# EAGLE schematic rf_rx (EAGLE 6.5.0)
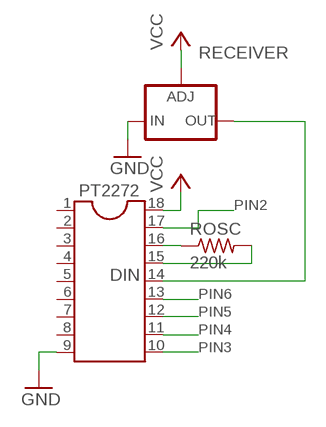
[diagram p0: schematic, sheet 1]

## Parts
PT2272  DIL18  [DIL18]
RECEIVER  LM337TS  [337TS]
ROSC  220k  R-US_0204/5  [0204/5]

## Nets
DIN: PT2272.14 RECEIVER.3(OUT)
GND: PT2272.9 RECEIVER.2(IN)
N$23: PT2272.16 ROSC.1
N$24: PT2272.15 ROSC.2
PIN2: PT2272.17
PIN3: PT2272.10
PIN4: PT2272.11
PIN5: PT2272.12
PIN6: PT2272.13
VCC: PT2272.18 RECEIVER.1(ADJ)
Unconnected: PT2272.1 PT2272.2 PT2272.3 PT2272.4 PT2272.5 PT2272.6 PT2272.7 PT2272.8

## Library data of the parts
PT2272 = ic-package:DIL18: Dual In Line / Socket
RECEIVER = v-reg:LM337TS: VOLTAGE REGULATOR
ROSC = resistor:R-US_: RESISTOR, American symbol